# EAGLE design EstlcamShield (EAGLE 9.3.0)
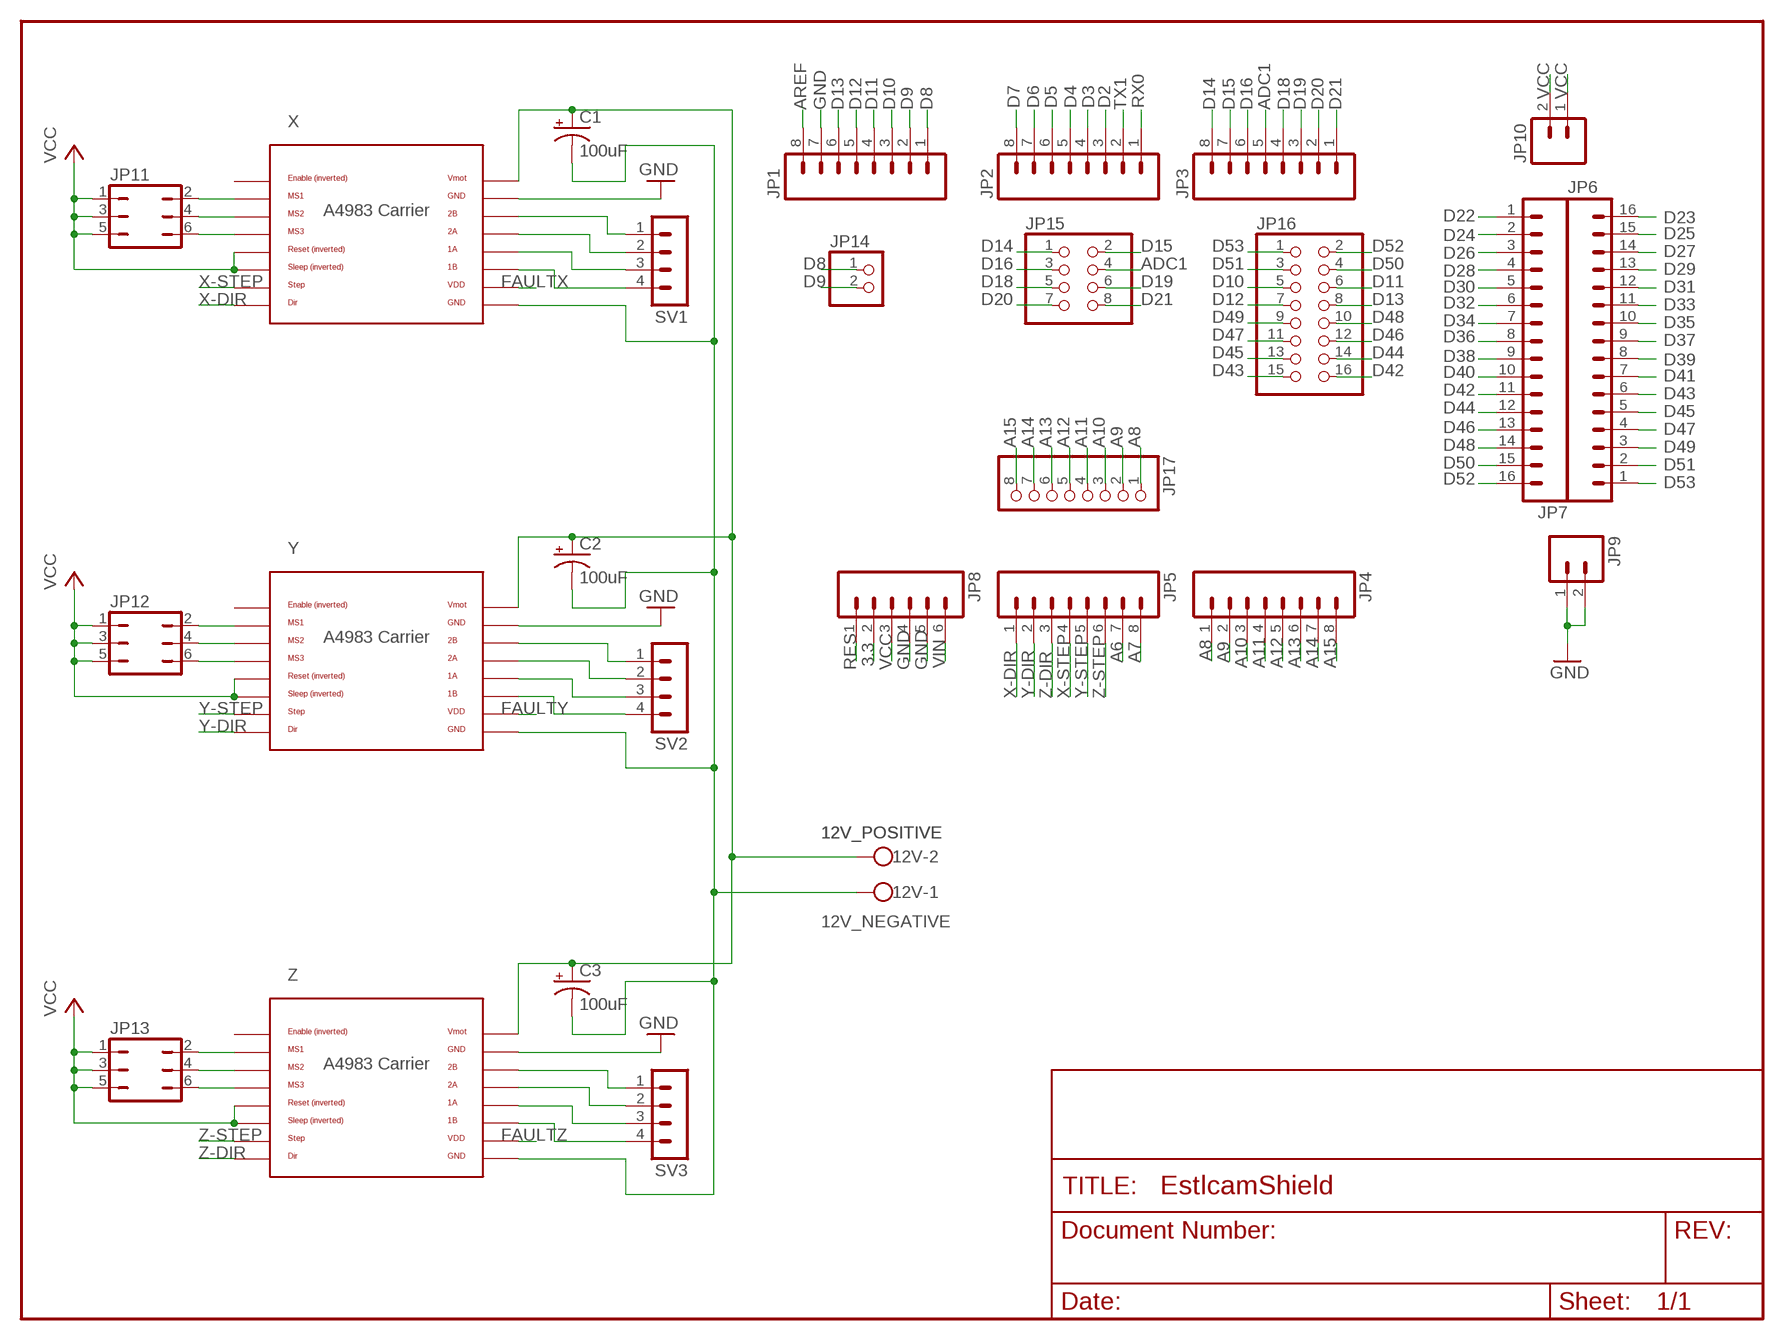
[diagram p0: schematic, sheet 1]

## Parts
12V  POSITIVE  W237-102  [W237-102]
C1  100uF  CPOL-USE2.5-5  [E2,5-5]
C2  100uF  CPOL-USE2.5-5  [E2,5-5]
C3  100uF  CPOL-USE2.5-5  [E2,5-5]
JP1  M08LOCK  [1X08_LOCK]
JP2  M08LOCK  [1X08_LOCK]
JP3  M08LOCK  [1X08_LOCK]
JP4  M08LOCK  [1X08_LOCK]
JP5  M08LOCK  [1X08_LOCK]
JP6  M16LOCK  [1X16_LOCK]
JP7  M16LOCK  [1X16_LOCK]
JP8  M06LOCK  [1X06_LOCK]
JP9  M02LOCK  [1X02_LOCK]
JP10  M02LOCK  [1X02_LOCK]
JP11  JP3Q  [JP3Q]
JP12  JP3Q  [JP3Q]
JP13  JP3Q  [JP3Q]
JP14  PINHD-1X2  [1X02]
JP15  PINHD-2X4  [2X04]
JP16  PINHD-2X8  [2X08]
JP17  PINHD-1X8  [1X08]
SV1  MA04-1  [MA04-1]
SV2  MA04-1  [MA04-1]
SV3  MA04-1  [MA04-1]
U2  POLOLU_A4983CARRIER  [A4983CARRIER]
U3  POLOLU_A4983CARRIER  [A4983CARRIER]
U4  POLOLU_A4983CARRIER  [A4983CARRIER]

## Nets
3.3: JP8.2
12V_NEGATIVE: 12V.1 C1.- C2.- C3.- U2.GND@0(GND) U3.GND@0(GND) U4.GND@0(GND)
12V_POSITIVE: 12V.2 C1.+ C2.+ C3.+ U2.VMOT U3.VMOT U4.VMOT
A6: JP5.7
A7: JP5.8
A8: JP4.1 JP17.1
A9: JP4.2 JP17.2
A10: JP4.3 JP17.3
A11: JP4.4 JP17.4
A12: JP4.5 JP17.5
A13: JP4.6 JP17.6
A14: JP4.7 JP17.7
A15: JP4.8 JP17.8
ADC1: JP3.5 JP15.4
AREF: JP1.8
D2: JP2.3
D3: JP2.4
D4: JP2.5
D5: JP2.6
D6: JP2.7
D7: JP2.8
D8: JP1.1 JP14.1
D9: JP1.2 JP14.2
D10: JP1.3 JP16.5
D11: JP1.4 JP16.6
D12: JP1.5 JP16.7
D13: JP1.6 JP16.8
D14: JP3.8 JP15.1
D15: JP3.7 JP15.2
D16: JP3.6 JP15.3
D18: JP3.4 JP15.5
D19: JP3.3 JP15.6
D20: JP3.2 JP15.7
D21: JP3.1 JP15.8
D22: JP7.1
D23: JP6.16
D24: JP7.2
D25: JP6.15
D26: JP7.3
D27: JP6.14
D28: JP7.4
D29: JP6.13
D30: JP7.5
D31: JP6.12
D32: JP7.6
D33: JP6.11
D34: JP7.7
D35: JP6.10
D36: JP7.8
D37: JP6.9
D38: JP7.9
D39: JP6.8
D40: JP7.10
D41: JP6.7
D42: JP7.11 JP16.16
D43: JP6.6 JP16.15
D44: JP7.12 JP16.14
D45: JP6.5 JP16.13
D46: JP7.13 JP16.12
D47: JP6.4 JP16.11
D48: JP7.14 JP16.10
D49: JP6.3 JP16.9
D50: JP7.15 JP16.4
D51: JP6.2 JP16.3
D52: JP7.16 JP16.2
D53: JP6.1 JP16.1
FAULTX: U2.VDD
FAULTY: U3.VDD
FAULTZ: U4.VDD
GND: JP1.7 JP8.4 JP8.5 JP9.1 JP9.2 U2.GND U3.GND U4.GND
N$1: JP11.2 U2.MS1
N$2: JP11.4 U2.MS2
N$3: JP12.2 U3.MS1
N$4: JP12.4 U3.MS2
N$5: JP13.2 U4.MS1
N$6: JP11.6 U2.MS3
N$7: JP13.4 U4.MS2
N$8: SV3.1 U4.2B
N$9: SV3.2 U4.2A
N$10: SV3.3 U4.1A
N$11: SV3.4 U4.1B
N$12: SV2.1 U3.2B
N$13: SV2.2 U3.2A
N$14: SV2.3 U3.1A
N$15: SV2.4 U3.1B
N$16: SV1.1 U2.2B
N$17: JP13.6 U4.MS3
N$18: SV1.2 U2.2A
N$19: JP12.6 U3.MS3
N$20: SV1.3 U2.1A
N$21: SV1.4 U2.1B
RES: JP8.1
RX0: JP2.1
TX1: JP2.2
VCC: JP8.3 JP10.1 JP10.2 JP11.1 JP11.3 JP11.5 JP12.1 JP12.3 JP12.5 JP13.1 JP13.3 JP13.5 U2.RST U2.SLP(SLEEP) U3.RST U3.SLP(SLEEP) U4.RST U4.SLP(SLEEP)
VIN: JP8.6
X-DIR: JP5.1 U2.DIR
X-STEP: JP5.4 U2.STEP
Y-DIR: JP5.2 U3.DIR
Y-STEP: JP5.5 U3.STEP
Z-DIR: JP5.3 U4.DIR
Z-STEP: JP5.6 U4.STEP
Unconnected: U2.EN U3.EN U4.EN

## Notes on the sheet
- X
- Y
- Z

## Library data of the parts
12V = con-wago-500:W237-102: WAGO SCREW CLAMP; MPN: 237-102; OC_FARNELL: unknown; OC_NEWARK: 70K9898
C1-C3 = adafruit:CPOL-US: POLARIZED CAPACITOR, American symbol
JP1-JP5 = SparkFun:M08: Header 8 Standard 8-pin 0.1" header. Use with straight break away headers (SKU : PRT-00116), right angle break away headers (PRT-00553), swiss pins (PRT-00743), machine pins (PRT-00117), and female headers (PRT-00115).
JP6 JP7 = SparkFun:M16
JP8 = SparkFun:M06: Header 6 Standard 6-pin 0.1" header. Use with straight break away headers (SKU : PRT-00116), right angle break away headers (PRT-00553), swiss pins (PRT-00743), machine pins (PRT-00117), and female headers (PRT-00115). Molex polarized connector foot print use with SKU : PRT-08094 with associated crimp pins and housings. NOTES ON THE VARIANTS LOCK and LOCK_LONGPADS... This footprint was designed to help hold the alignment of a through-hole component (i.e. 6-pin header) while soldering it into place. You may notice that each hole has been shifted either up or down by 0.005 of an inch from it's more standard position (which is a perfectly straight line). This slight alteration caused the pins (the squares in the middle) to touch the edges of the holes. Because they are alternating, it causes a "brace" to hold the component in place. 0.005 has proven to be the perfect amount of "off-center" position when using our standard breakaway headers. Although looks a little odd when you look at the bare footprint, once you have a header in there, the alteration is very hard to notice. Also, if you push a header all the way into place, it is covered up entirely on the bottom side. This idea of altering the position of holes to aid alignment will be further integrated into the Sparkfun Library for other footprints. It can help hold any component with 3 or more connection pins.
JP9 JP10 = SparkFun:M02: Header 2 Standard 2-pin 0.1" header. Use with straight break away headers (SKU : PRT-00116), right angle break away headers (PRT-00553), swiss pins (PRT-00743), machine pins (PRT-00117), and female headers (PRT-00115). Molex polarized connector foot print use with SKU : PRT-08233 with associated crimp pins and housings.
JP11-JP13 = jumper:JP3Q: JUMPER
JP14 = pinhead:PINHD-1X2: PIN HEADER
JP15 = pinhead:PINHD-2X4: PIN HEADER
JP16 = pinhead:PINHD-2X8: PIN HEADER
JP17 = pinhead:PINHD-1X8: PIN HEADER
SV1-SV3 = con-lstb:MA04-1: PIN HEADER; OC_FARNELL: unknown; OC_NEWARK: unknown
U2-U4 = ultimachine:POLOLU_A4983CARRIER

## Board
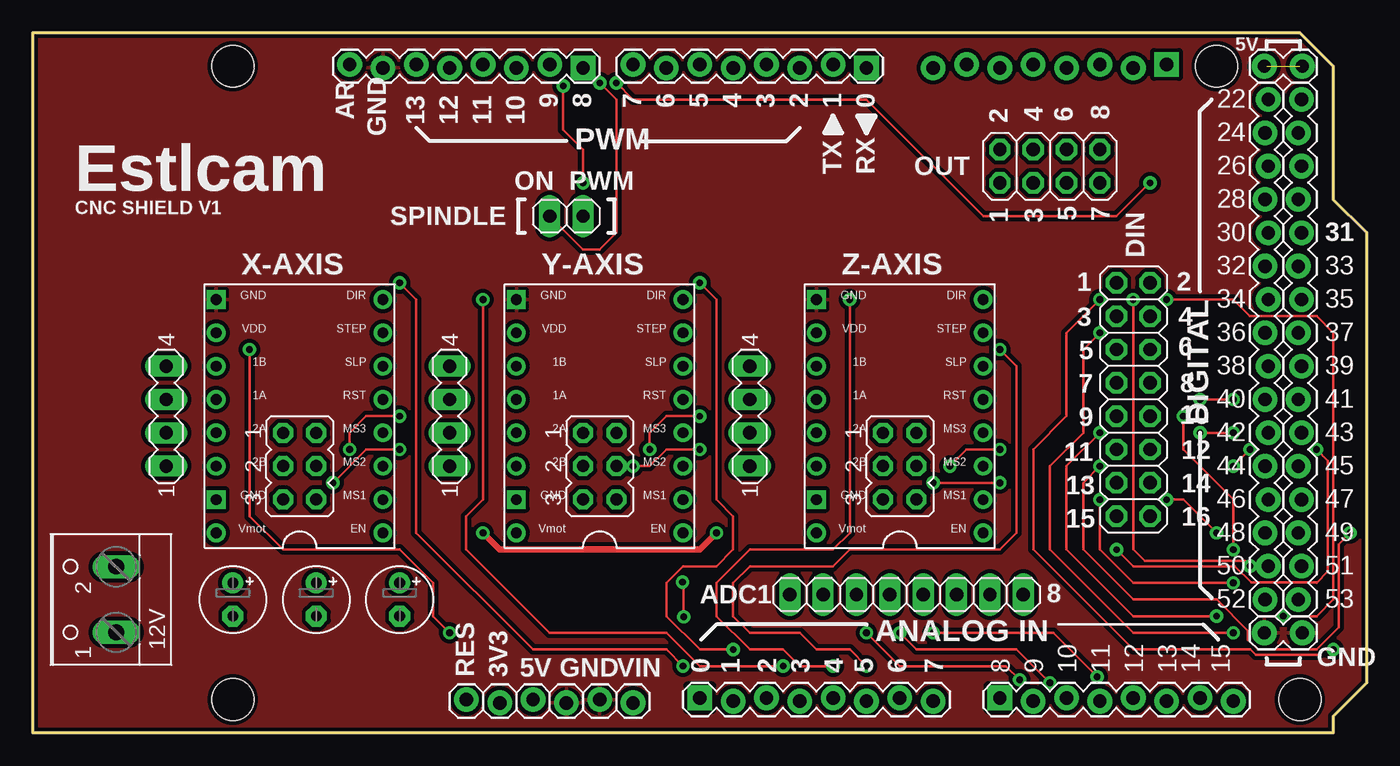
[diagram p1: board, top side]
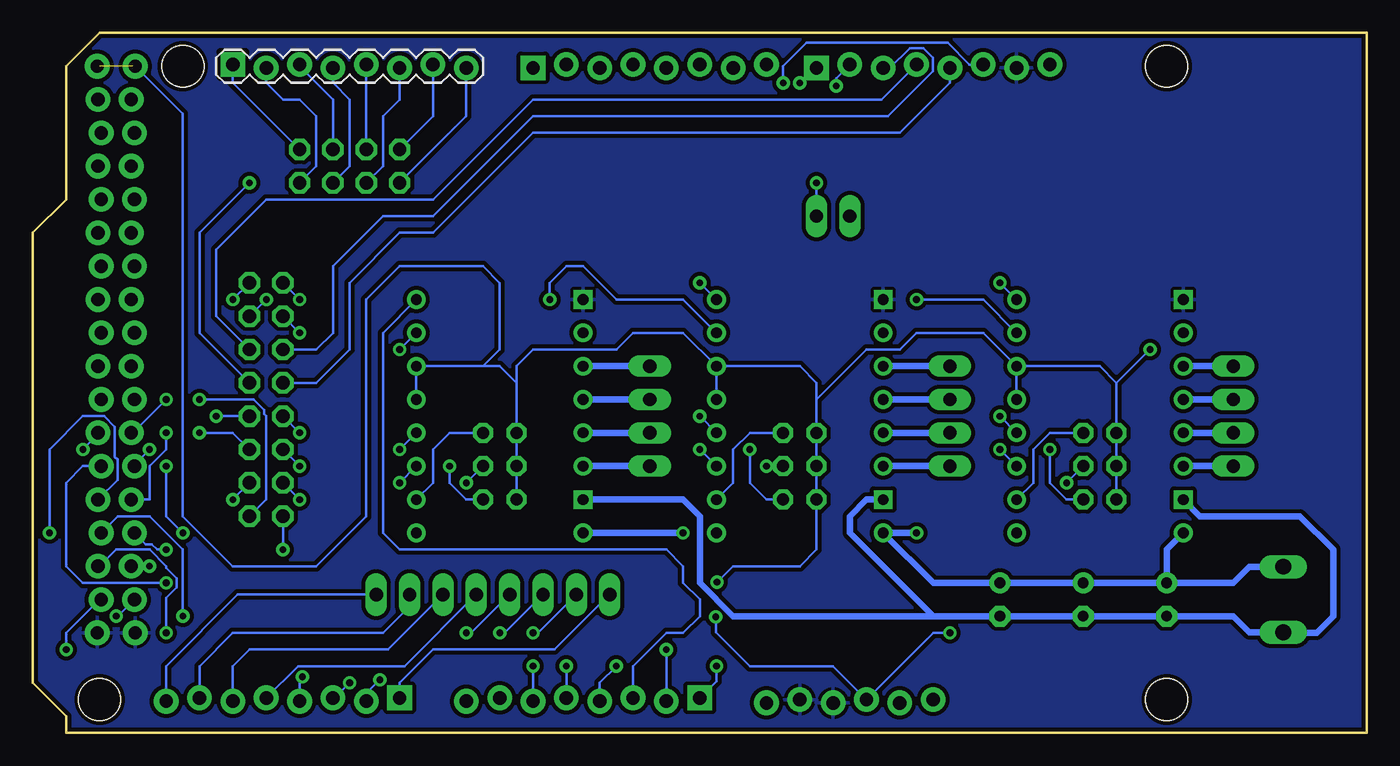
[diagram p2: board, bottom side, seen from below]

Size 101.6 x 53.34 mm. Coordinates in mm from the lower left corner, seen from the top.
Outline: 0,0 99.06,0 99.06,1.27 101.6,3.81 101.6,38.1 99.06,40.64 99.06,50.8 96.52,53.34 0,53.34 0,0
Copper layers (1*16): Top 0.035mm / dielectric 1.5mm / Bottom 0.035mm
Design rules "SparkFun": minimum track width 8mil, minimum drill 20mil, track to track 8mil, track to pad 8mil, pad to pad 8mil, via to via 8mil, smd to smd 8mil, copper to edge 10mil, drill to drill 8mil, minimum pad ring 12mil, minimum via ring 10mil, stop-mask expansion 4mil, vias tented up to drill 25mil, thermal gap 10mil
Holes 3.2 mm at 15.24,50.8 15.24,2.54 90.17,50.8 96.52,2.54

### Footprints (pad centres in the part's own frame; a part is rotated, then mirrored left to right if it is on the bottom)
W237-102 = drill 1.194 long: 1 -2.5,-1.27; 2 2.5,-1.27
E2,5-5 = drill 0.813 pad 1.6: + -1.27,0 | drill 0.813 pad 1.6 octagon: - 1.27,0
1X08_LOCK = drill 1.016 pad 1.88 square: 1 0,0.127 | drill 1.016 pad 1.88: 2 2.54,-0.127; 3 5.08,0.127; 4 7.62,-0.127; 5 10.16,0.127; 6 12.7,-0.127; 7 15.24,0.127; 8 17.78,-0.127
1X16_LOCK = drill 1.016 pad 1.88: 1 0,0.127; 2 2.54,-0.127; 3 5.08,0.127; 4 7.62,-0.127; 5 10.16,0.127; 6 12.7,-0.127; 7 15.24,0.127; 8 17.78,-0.127; 9 20.32,0.127; 10 22.86,-0.127; 11 25.4,0.127; 12 27.94,-0.127; 13 30.48,0.127; 14 33.02,-0.127; 15 35.56,0.127; 16 38.1,-0.127
1X06_LOCK = drill 1.016 pad 1.88: 1 0,0; 2 2.54,-0.254; 3 5.08,0; 4 7.62,-0.254; 5 10.16,0; 6 12.7,-0.254
1X02_LOCK = drill 1.016 pad 1.88: 1 -0.178,0; 2 2.718,0
JP3Q = drill 0.914 octagon: 1 -2.54,-1.27; 2 -2.54,1.27; 3 0,-1.27; 4 0,1.27; 5 2.54,-1.27; 6 2.54,1.27
1X02 = drill 1.016 long: 1 -1.27,0; 2 1.27,0
2X04 = drill 1.016 octagon: 1 -3.81,-1.27; 2 -3.81,1.27; 3 -1.27,-1.27; 4 -1.27,1.27; 5 1.27,-1.27; 6 1.27,1.27; 7 3.81,-1.27; 8 3.81,1.27
2X08 = drill 1.016 octagon: 1 -8.89,-1.27; 2 -8.89,1.27; 3 -6.35,-1.27; 4 -6.35,1.27; 5 -3.81,-1.27; 6 -3.81,1.27; 7 -1.27,-1.27; 8 -1.27,1.27; 9 1.27,-1.27; 10 1.27,1.27; 11 3.81,-1.27; 12 3.81,1.27; 13 6.35,-1.27; 14 6.35,1.27; 15 8.89,-1.27; 16 8.89,1.27
1X08 = drill 1.016 long: 1 -8.89,0; 2 -6.35,0; 3 -3.81,0; 4 -1.27,0; 5 1.27,0; 6 3.81,0; 7 6.35,0; 8 8.89,0
MA04-1 = drill 1.016 long: 1 -3.81,0; 2 -1.27,0; 3 1.27,0; 4 3.81,0
A4983CARRIER = drill 0.813: 1A 8.89,1.27; 1B 11.43,1.27; 2A 6.35,1.27; 2B 3.81,1.27; DIR 16.51,-11.43; EN -1.27,-11.43; MS1 1.27,-11.43; MS2 3.81,-11.43; MS3 6.35,-11.43; RST 8.89,-11.43; SLP 11.43,-11.43; STEP 13.97,-11.43; VDD 13.97,1.27; VMOT -1.27,1.27 | drill 0.813 square: GND 16.51,1.27; GND@0 1.27,1.27

### Placement (x,y rotation side)
12V  5.08,10.16 90 top
C1  27.94,10.16 270 top
C2  15.24,10.16 270 top
C3  21.59,10.16 270 top
JP1  41.91,50.8 180 top
JP2  63.5,50.8 180 top
JP3  86.36,50.8 0 bottom
JP4  73.66,2.54 0 top
JP5  50.8,2.54 0 top
JP6  96.52,10.16 90 top
JP7  93.98,48.26 270 top
JP8  33.02,2.54 0 top
JP9  93.98,7.62 0 top
JP10  93.98,50.8 0 top
JP11  20.32,20.32 270 top
JP12  43.18,20.32 270 top
JP13  66.04,20.32 270 top
JP14  40.64,39.37 0 top
JP15  77.47,43.18 0 top
JP16  83.82,25.4 270 top
JP17  66.55,10.54 0 top
SV1  10.16,24.13 90 top
SV2  31.75,24.13 90 top
SV3  54.61,24.13 90 top
U2  15.24,16.51 90 top
U3  38.1,16.51 90 top
U4  60.96,16.51 90 top

### Tracks (layer width: path | path; a pad name or v marks a point on that pad's centre or on a via)
3.3
  Top 0.203: JP8.2 35.56,2.54
12V_NEGATIVE
  Bottom 0.508: U2.GND@0 12.7,16.51 5.08,16.51 2.54,13.97 2.54,8.89 3.81,7.62 6.31,7.62 12V.1 8.93,7.66 10.16,8.89 C2.- C3.- C1.- 33.02,8.89 | 33.02,8.89 39.37,15.24 39.37,16.51 38.1,17.78 U3.GND@0 | 33.02,8.89 48.26,8.89 50.8,11.43 50.8,16.51 52.07,17.78 U4.GND@0
12V_POSITIVE  (via drill 0.51)
  Top 0.508: v34.29,15.24 35.56,13.97 50.8,13.97 v52.07,15.24
  Bottom 0.508: 12V.2 8.93,12.66 10.16,11.43 C2.+ | C2.+ C3.+ C1.+ 33.02,11.43 U3.VMOT v34.29,15.24 | U2.VMOT 15.24,13.97 C2.+ | U4.VMOT v52.07,15.24
A6
  Top 0.203: JP5.7 66.04,2.54
A7
  Top 0.203: JP5.8 68.58,2.54
A8
  Top 0.203: 73.66,2.54 JP4.1
  Bottom 0.203: JP17.1 61.85,6.35 71.12,6.35 73.66,3.81 JP4.1
A9  (via drill 0.51)
  Top 0.203: 76.2,2.54 JP4.2 | v63.5,7.62 66.04,5.08 74.13,5.08 v75.17,4.05
  Bottom 0.203: JP17.2 63.12,7.62 v63.5,7.62 | v75.17,4.05 76.2,3.01 JP4.2
A10  (via drill 0.51)
  Top 0.203: 78.74,2.54 JP4.3 | v66.04,7.62 67.31,6.35 74.93,6.35 v77.47,3.81
  Bottom 0.203: JP17.3 65.66,7.62 v66.04,7.62 | v77.47,3.81 78.61,2.67 JP4.3
A11  (via drill 0.51)
  Top 0.203: 81.28,2.54 JP4.4 | v68.58,7.62 77.72,7.62 v81.07,4.27
  Bottom 0.203: JP17.4 68.2,7.62 v68.58,7.62 | v81.07,4.27 81.28,4.06 JP4.4
A12
  Top 0.203: 83.82,2.54 JP4.5
  Bottom 0.203: JP17.5 73.28,5.08 81.41,5.08 JP4.5
A13
  Top 0.203: 86.36,2.54 JP4.6
  Bottom 0.203: JP17.6 74.55,6.35 85.09,6.35 86.36,5.08 JP4.6
A14
  Top 0.203: 88.9,2.54 JP4.7
  Bottom 0.203: JP17.7 72.9,9.65 74.93,7.62 86.36,7.62 88.9,5.08 JP4.7
A15
  Top 0.203: 91.44,2.54 JP4.8
  Bottom 0.203: JP17.8 85.98,10.54 91.44,5.08 JP4.8
ADC1
  Bottom 0.203: JP15.4 JP3.5
AREF
  Top 0.203: JP1.8 24.13,50.8
D2
  Top 0.203: JP2.3 58.42,50.8
D3
  Top 0.203: JP2.4 55.88,50.8
D4
  Top 0.203: JP2.5 53.34,50.8
D5
  Top 0.203: JP2.6 50.8,50.8
D6
  Top 0.203: JP2.7 48.26,50.8
D7
  Top 0.203: JP2.8 45.72,50.8
D8  (via drill 0.51)
  Top 0.203: 41.91,50.8 JP1.1 | JP14.1 41.91,36.83 43.18,36.83 44.45,38.1 44.45,48.26 v43.18,49.53
  Bottom 0.203: v43.18,49.53 42.04,50.67 JP1.1
D9  (via drill 0.51)
  Top 0.203: 39.37,50.8 JP1.2 | v40.4,49.29 40.4,46.99 40.4,46.75 40.4,45.96 41.91,44.45 v41.91,41.91
  Bottom 0.203: JP1.2 40.4,49.89 v40.4,49.29 | v41.91,41.91 JP14.2
D10
  Top 0.203: JP1.3 36.83,50.8
  Bottom 0.203: JP16.5 80.01,29.21 78.74,30.48 78.74,35.56 74.93,39.37 71.12,39.37 63.5,46.99 36.47,46.99 33.05,50.41 33.05,51.44 33.77,52.17 34.81,52.17 36.3,50.67 JP1.3
D11
  Top 0.203: JP1.4 34.29,50.8
  Bottom 0.203: JP16.6 87.63,31.75 87.63,36.83 83.82,40.64 71.12,40.64 63.5,48.26 36.96,48.26 JP1.4
D12
  Top 0.203: JP1.5 31.75,50.8
  Bottom 0.203: JP16.7 80.01,26.67 77.47,29.21 77.47,34.29 73.66,38.1 71.12,38.1 63.5,45.72 35.56,45.72 31.75,49.53 JP1.5
D13  (via drill 0.51)
  Top 0.203: v85.09,41.91 82.55,39.37 72.39,39.37 63.5,48.26 45.72,48.26 v44.45,49.53
  Top 0.254: 29.21,50.8 JP1.6
  Bottom 0.203: JP16.8 88.9,30.48 88.9,38.1 v85.09,41.91 | JP1.6 30.24,50.93 31.89,52.58 42.67,52.58 44.45,50.8 v44.45,49.53
D14
  Bottom 0.203: 68.58,50.8 JP3.8 68.58,46.99 JP15.1
D15
  Bottom 0.203: JP15.2 71.12,46.99 JP3.7
D16
  Bottom 0.203: 73.66,50.8 JP3.6 73.66,48.26 74.93,46.99 74.93,43.18 JP15.3
D18
  Bottom 0.203: 78.74,50.8 JP3.4 78.74,49.53 77.47,48.26 77.47,43.18 JP15.5
D19
  Bottom 0.203: JP3.3 81.28,50.8 78.74,48.26 JP15.6
D20
  Bottom 0.203: 83.82,50.8 JP3.2 83.82,49.53 82.55,48.26 81.28,48.26 80.01,46.99 80.01,43.18 JP15.7
D21
  Bottom 0.203: JP15.8 86.36,49.53 JP3.1
D42  (via drill 0.51)
  Top 0.203: v88.9,25.4 v91.44,25.4
  Bottom 0.203: JP16.16 83.82,17.78 83.82,24.13 83.97,24.28 83.97,24.59 84.78,25.4 v88.9,25.4 | v91.44,25.4 93.98,22.86 JP7.11
D43  (via drill 0.51)
  Top 0.203: v82.55,13.97 83.82,12.7 91.56,12.7 92.81,11.46 97.77,11.46 97.79,11.43 98.65,12.29 98.65,20.73 v97.79,21.59
  Bottom 0.203: JP16.15 v82.55,13.97 | v97.79,21.59 96.65,22.73 JP6.6
D44  (via drill 0.51)
  Top 0.203: v86.36,17.78 87.63,17.78 v90.17,15.24 | v91.44,20.32 v92.71,21.59
  Bottom 0.203: JP16.14 v86.36,17.78 | v90.17,15.24 91.44,16.51 v91.44,20.32 | v92.71,21.59 93.85,20.45 JP7.12
D45  (via drill 0.51)
  Top 0.203: v81.28,17.78 81.28,13.97 83.82,11.43 86.36,11.43 v91.44,11.43
  Bottom 0.203: JP16.13 v81.28,17.78 | 96.39,20.19 JP6.5 97.79,20.32 99.06,19.05 99.06,12.7 97.79,11.43 v91.44,11.43
D46  (via drill 0.51)
  Top 0.203: v88.9,22.86 v91.44,22.86
  Bottom 0.203: JP16.12 86.36,22.86 v88.9,22.86 | v91.44,22.86 91.44,21.59 92.71,20.32 92.71,17.78 JP7.13
D47  (via drill 0.51)
  Top 0.203: v81.28,20.32 80.01,19.05 80.01,13.97 83.82,10.16 86.36,10.16 90.17,10.16 92.56,7.77 92.56,7.1 93.31,6.35 97.79,6.35 99.47,8.03 99.47,14.38 v100.33,15.24
  Bottom 0.203: JP16.11 v81.28,20.32 | JP6.4 95.15,19.28 95.15,20.84 95.35,21.04 95.35,23.32 96.16,24.13 97.79,24.13 100.33,21.59 v100.33,15.24
D48  (via drill 0.51)
  Top 0.203: v91.44,13.97 91.44,17.78 87.63,21.59 v87.63,24.13
  Bottom 0.203: JP7.14 92.99,14.38 92.54,14.38 92.14,13.97 v91.44,13.97 | v87.63,24.13 JP16.10
D49  (via drill 0.51)
  Top 0.203: v81.28,22.86 78.74,20.32 78.74,13.97 83.82,8.89 v90.17,8.89
  Bottom 0.203: JP16.9 v81.28,22.86 | v90.17,8.89 90.17,13.97 92.71,16.51 95.12,16.51 JP6.3
D50  (via drill 0.51)
  Top 0.203: v83.82,33.02 83.82,13.97 84.68,13.11 92.3,13.11 v92.71,12.7
  Bottom 0.203: JP16.4 v83.82,33.02 | v92.71,12.7 JP7.15
D51  (via drill 0.51)
  Top 0.203: v81.28,30.48 80.01,29.21 80.01,22.86 77.47,20.32 77.47,13.97 83.82,7.62 v91.44,7.62
  Bottom 0.203: JP16.3 v81.28,30.48 | JP6.2 96.52,12.7 95.25,13.97 92.71,13.97 91.44,12.7 91.44,12.58 90.63,11.77 90.63,11.09 91.44,10.28 v91.44,7.62
D52  (via drill 0.51)
  Top 0.203: v95.25,8.89 97.79,8.89 99.06,10.16 99.06,30.48 97.79,31.75 92.71,31.75 91.44,33.02 v86.36,33.02
  Bottom 0.203: JP16.2 v86.36,33.02 | v95.25,8.89 95.12,8.89 JP7.16
D53  (via drill 0.51)
  Top 0.203: v81.28,33.02 78.74,30.48 78.74,24.13 76.2,21.59 76.2,13.97 83.82,6.35 92.74,6.35 93.14,5.94 97.96,5.94 98.36,6.35 v99.06,6.35
  Bottom 0.203: JP16.1 v81.28,33.02 | 96.39,10.03 JP6.1 96.52,10.16 99.06,7.62 v99.06,6.35
GND
  pour Bottom (isolate 0.305): 0,0 99.06,0 99.06,1.27 101.6,3.81 101.6,38.1 99.06,40.64 99.06,50.8 96.52,53.34 0,53.34 0,2.54
  pour Top (isolate 0.305): 0,0 99.06,0 99.06,1.27 101.6,3.81 101.6,38.1 99.06,40.64 99.06,50.8 96.52,53.34 0,53.34 0,2.54
N$1
  Bottom 0.203: JP11.2 24.13,22.86 25.4,21.59 25.4,19.05 U2.MS1
N$2  (via drill 0.51)
  Top 0.203: v27.94,21.59 25.4,21.59 v22.86,19.05
  Bottom 0.203: JP11.4 v22.86,19.05 | v27.94,21.59 U2.MS2
N$3
  Bottom 0.203: JP12.2 46.99,22.86 48.26,21.59 48.26,19.05 U3.MS1
N$4  (via drill 0.51)
  Top 0.203: v45.72,20.32 46.99,20.32 48.26,21.59 v50.8,21.59
  Bottom 0.203: JP12.4 v45.72,20.32 | v50.8,21.59 U3.MS2
N$5
  Bottom 0.203: JP13.2 69.85,22.86 71.12,21.59 71.12,19.05 U4.MS1
N$6  (via drill 0.51)
  Top 0.203: v24.13,21.59 24.13,22.86 25.4,24.13 v27.94,24.13
  Bottom 0.203: JP11.6 22.86,17.78 24.13,19.05 v24.13,21.59 | v27.94,24.13 U2.MS3
N$7  (via drill 0.51)
  Top 0.203: v68.58,19.05 v73.66,19.05
  Bottom 0.203: JP13.4 v68.58,19.05 | v73.66,19.05 U4.MS2
N$8
  Bottom 0.508: U4.2B SV3.1
N$9
  Bottom 0.508: SV3.2 U4.2A
N$10
  Bottom 0.508: U4.1A SV3.3
N$11
  Bottom 0.508: U4.1B SV3.4
N$12
  Bottom 0.508: U3.2B SV2.1
N$13
  Bottom 0.508: U3.2A SV2.2
N$14
  Bottom 0.508: U3.1A SV2.3
N$15
  Bottom 0.508: U3.1B SV2.4
N$16
  Bottom 0.508: SV1.1 U2.2B
N$17  (via drill 0.51)
  Top 0.203: v69.85,20.32 71.12,21.59 v73.66,21.59
  Bottom 0.203: JP13.6 68.58,17.78 69.85,19.05 v69.85,20.32 | v73.66,21.59 U4.MS3
N$18
  Bottom 0.508: U2.2A SV1.2
N$19  (via drill 0.51)
  Top 0.203: v46.99,21.59 46.99,22.86 48.26,24.13 v50.8,24.13
  Bottom 0.203: JP12.6 45.72,17.78 46.99,19.05 v46.99,21.59 | v50.8,24.13 U3.MS3
N$20
  Bottom 0.508: U2.1A SV1.3
N$21
  Bottom 0.508: U2.1B SV1.4
RX0
  Top 0.203: JP2.1 63.5,50.8
TX1
  Top 0.203: JP2.2 60.96,50.8
VCC  (via drill 0.51)  (1 unrouted)
  Top 0.203: v31.75,7.62 30.48,8.89 30.48,11.43 27.94,13.97 19.05,13.97 16.51,16.51 v16.51,29.21 | v49.58,8.84 49.58,11.38 v49.48,11.48
  Bottom 0.203: 19.05,26.67 JP11.1 JP11.3 JP11.5 | U2.RST U2.SLP | U2.SLP 20.32,27.94 19.05,26.67 | U2.SLP 29.21,30.48 34.29,30.48 35.56,29.21 38.1,29.21 41.91,25.4 | 41.91,25.4 41.91,26.67 43.18,27.94 U3.SLP | 41.91,25.4 JP12.1 JP12.3 JP12.5 41.91,13.97 43.18,12.7 48.26,12.7 v49.48,11.48 | U3.SLP U3.RST | 64.77,26.67 64.77,27.94 63.5,29.21 57.15,29.21 55.88,30.48 52.07,30.48 U3.SLP | 64.77,26.67 JP13.1 JP13.3 JP13.5 | 64.77,26.67 66.04,27.94 67.31,27.94 | 67.31,27.94 U4.SLP U4.RST | v31.75,7.62 33.02,7.62 JP8.3 40.64,5.08 46.99,5.08 49.58,7.67 v49.58,8.84 | v16.51,29.21 19.05,26.67 | JP10.1 90.17,47.17 90.17,16.51 86.36,12.7 80.01,12.7 76.2,16.51 76.2,33.02 73.66,35.56 67.31,35.56 66.04,34.29 66.04,29.21 67.31,27.94
  Bottom 1.27: 96.52,50.8 JP10.2 | 93.98,50.8 JP10.1
VIN
  Top 0.203: JP8.6 45.72,2.54
X-DIR  (via drill 0.51)
  Top 0.203: 50.8,2.54 JP5.1 | v27.94,34.29 29.21,33.02 29.21,15.24 38.1,6.35 48.26,6.35 v49.53,5.08
  Bottom 0.203: U2.DIR v27.94,34.29 | v49.53,5.08 49.53,3.94 JP5.1
X-STEP  (via drill 0.51)
  Top 0.203: JP5.4 58.42,2.54 | v34.29,33.02 34.29,17.78 33.02,16.51 33.02,13.97 39.37,7.62 48.26,7.62 50.8,5.08 v57.15,5.08
  Bottom 0.203: U2.STEP 29.21,33.02 v34.29,33.02 | v57.15,5.08 58.42,3.81 JP5.4
Y-DIR  (via drill 0.51)
  Top 0.203: JP5.2 53.34,2.54 | v50.8,34.29 52.07,33.02 52.07,17.78 53.34,16.51 53.34,13.97 52.07,12.7 49.53,12.7 48.26,11.43 48.26,8.89 50.8,6.35 v53.34,6.35
  Bottom 0.203: U3.DIR v50.8,34.29 | v53.34,6.35 JP5.2
Y-STEP  (via drill 0.51)
  Top 0.203: 60.96,2.54 JP5.5 | v62.23,33.02 62.23,15.24 60.96,13.97 54.61,13.97 52.07,11.43 52.07,8.89 54.61,6.35 57.15,6.35 58.42,5.08 v60.96,5.08
  Bottom 0.203: U3.STEP 52.07,33.02 57.15,33.02 59.69,35.56 60.96,35.56 62.23,34.29 v62.23,33.02 | v60.96,5.08 JP5.5
Z-DIR
  Top 0.203: JP5.3 55.88,2.54
  Bottom 0.203: U4.DIR 74.93,30.48 74.93,15.24 73.66,13.97 62.23,13.97 53.34,13.97 52.07,12.7 52.07,11.43 50.8,10.16 50.8,8.89 52.07,7.62 53.34,7.62 55.88,5.08 JP5.3
Z-STEP  (via drill 0.51)
  Top 0.203: 63.5,2.54 JP5.6 | v73.66,29.21 74.93,27.94 74.93,15.24 73.66,13.97 62.23,13.97 60.96,12.7 54.61,12.7 53.34,11.43 53.34,8.89 54.61,7.62 58.42,7.62 59.69,6.35 62.23,6.35 v63.5,5.08
  Bottom 0.203: U4.STEP v73.66,29.21 | v63.5,5.08 JP5.6

### Text on the board
tPlace: 5V | 9 | 8 | 7 | 6 | 5 | 4 | 3 | 2 | 1 | 0 | 22 | AR | 4 | 6 | 8 | 13 | 12 | 11 | 10 | 2 | GND | 24 | PWM | OUT | ON | PWM | TX | RX | 26 | Estlcam | SPINDLE | 1 | 3 | 5 | 7 | 28 | CNC SHIELD V1 | 30 | 31 | DIN | X-AXIS | Y-AXIS | Z-AXIS | 1 | 32 | 33 | 2 | 3 | 34 | 35 | 4 | 5 | 36 | 37 | 6 | 7 | 38 | 39 | 8 | 9 | 40 | 41 | 10 | DIGITAL | 11 | 42 | 43 | 12 | 13 | 44 | 45 | 14 | 15 | 46 | 47 | 16 | 48 | 49 | 50 | 51 | ADC1 | 8 | 52 | 53 | ANALOG IN | 0 | 1 | 2 | 3 | 4 | 5 | 6 | 7 | 8 | 9 | 10 | 11 | 12 | 13 | 14 | 15 | GND | RES | 3V3 | 5V | GND | VIN